# Altium schematic sheet QCopterMV_MAIN_Sch.SchDoc
size A4
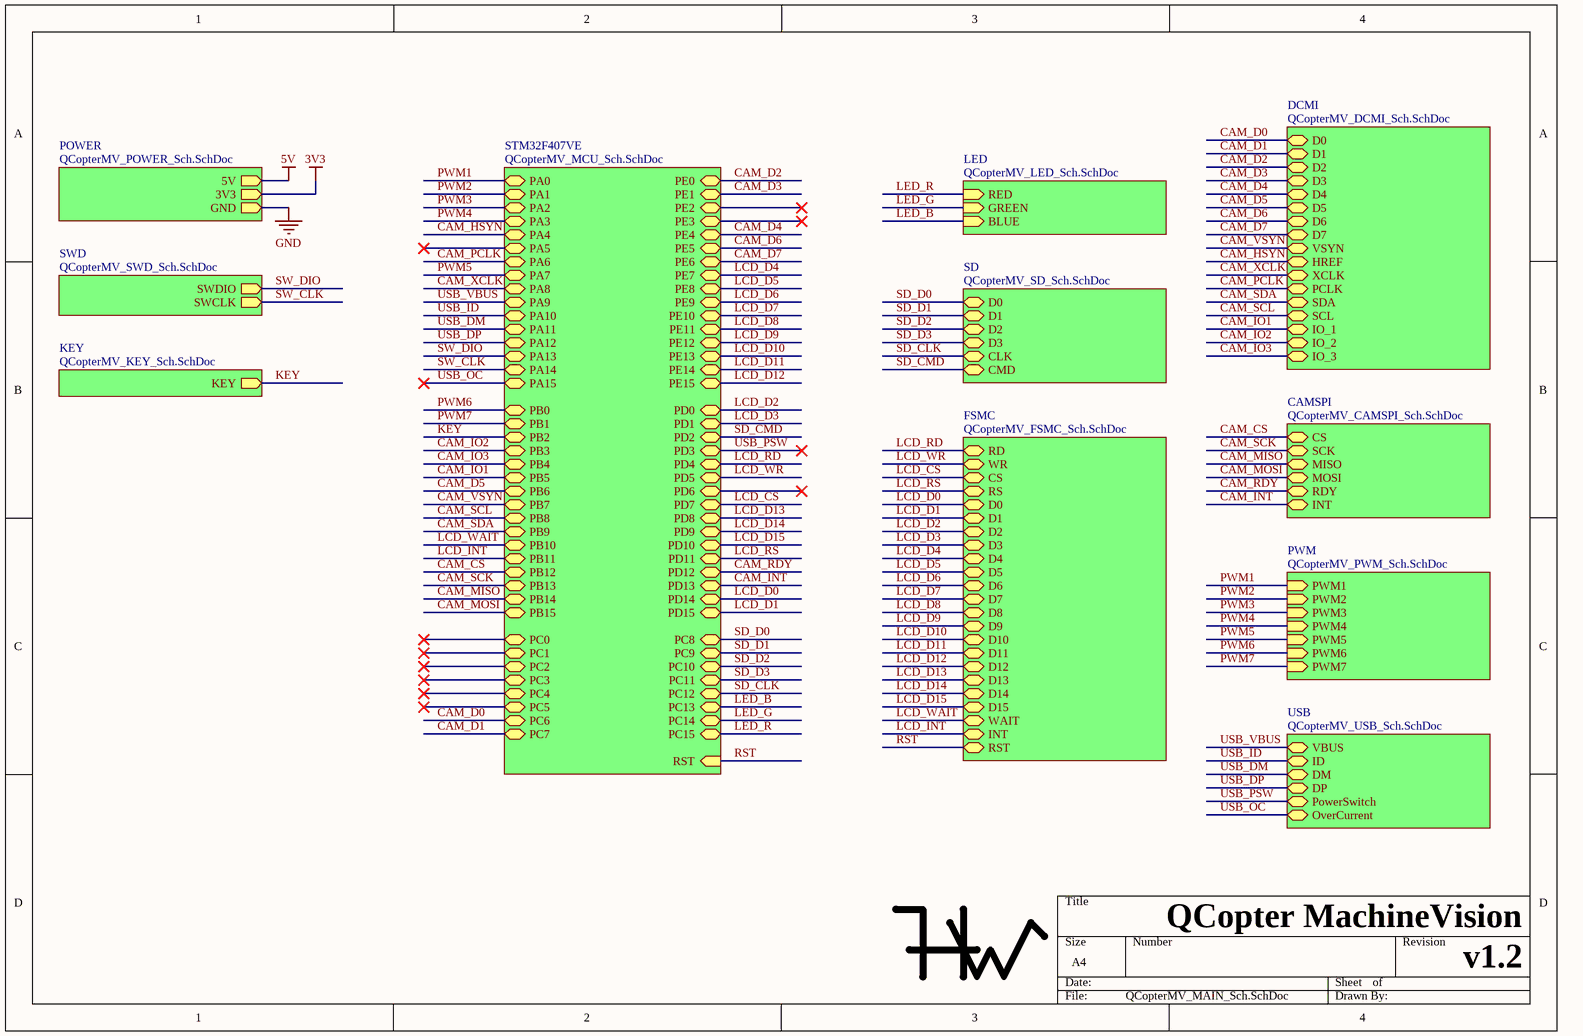
[diagram p0: QCopterMV_MAIN_Sch.SchDoc]

## Parts
Mark1  Mark  [HW_Mark]  (value not drawn)

## Sub-sheets
CAMSPI = QCopterMV_CAMSPI_Sch.SchDoc: MISO, CS, MOSI, SCK, RDY, INT
DCMI = QCopterMV_DCMI_Sch.SchDoc: D1, D0, D2, D3, D4, VSYN, HREF, PCLK, XCLK, SCL, SDA, D5, D6, D7, IO_1, IO_2, IO_3
FSMC = QCopterMV_FSMC_Sch.SchDoc: RS, CS, WR, RD, RST, D0, D1, D2, D3, D4, D5, D6, D7, D8, D9, D10, D11, D12, D13, D14, D15, WAIT, INT
KEY = QCopterMV_KEY_Sch.SchDoc: KEY (out)
LED = QCopterMV_LED_Sch.SchDoc: RED (in), GREEN (in), BLUE (in)
POWER = QCopterMV_POWER_Sch.SchDoc: 3V3 (out), 5V (out), GND (out)
PWM = QCopterMV_PWM_Sch.SchDoc: PWM7 (in), PWM1 (in), PWM2 (in), PWM3 (in), PWM4 (in), PWM5 (in), PWM6 (in)
SD = QCopterMV_SD_Sch.SchDoc: D0, CLK, CMD, D1, D2, D3
STM32F407VE = QCopterMV_MCU_Sch.SchDoc: PA0, PA1, PA2, PA3, PA4, PA5, PA6, PA7, PA8, PA9, PA10, PA11, PA12, PA13, PA14, PA15, PB0, PB1, PB2, PB3, PB4, PB5, PB6, PB7, PB8, PB9, PB10, PB11, PB12, PB13, PB14, PB15, PC0, PC1, PC2, PC3, PC4, PC5, PC6, PC7, PC8, PC9, PC10, PC11, PC12, PC13, PC14, PC15, PD0, PD1, PD2, PD3, PD4, PD5, PD6, PD7, PD8, PD9, PD10, PD11, PD12, PD13, PD14, PD15, RST (in), PE0, PE1, PE2, PE3, PE4, PE5, PE6, PE7, PE8, PE9, PE10, PE11, PE12, PE13, PE14, PE15
SWD = QCopterMV_SWD_Sch.SchDoc: SWDIO (out), SWCLK (out)
USB = QCopterMV_USB_Sch.SchDoc: VBUS, ID, DM, DP, PowerSwitch, OverCurrent

## Nets
3V3: sheet POWER/3V3
5V: sheet POWER/5V
GND: sheet POWER/GND
CAM_CS: sheet STM32F407VE/PB12, sheet CAMSPI/CS
CAM_D0: sheet DCMI/D0, sheet STM32F407VE/PC6
CAM_D1: sheet DCMI/D1, sheet STM32F407VE/PC7
CAM_D2: sheet DCMI/D2, sheet STM32F407VE/PE0
CAM_D3: sheet DCMI/D3, sheet STM32F407VE/PE1
CAM_D4: sheet DCMI/D4, sheet STM32F407VE/PE4
CAM_D5: sheet DCMI/D5, sheet STM32F407VE/PB6
CAM_D6: sheet DCMI/D6, sheet STM32F407VE/PE5
CAM_D7: sheet DCMI/D7, sheet STM32F407VE/PE6
CAM_HSYN: sheet DCMI/HREF, sheet STM32F407VE/PA4
CAM_INT: sheet STM32F407VE/PD13, sheet CAMSPI/INT
CAM_IO1: sheet DCMI/IO_1, sheet STM32F407VE/PB5
CAM_IO2: sheet DCMI/IO_2, sheet STM32F407VE/PB3
CAM_IO3: sheet DCMI/IO_3, sheet STM32F407VE/PB4
CAM_MISO: sheet STM32F407VE/PB14, sheet CAMSPI/MISO
CAM_MOSI: sheet STM32F407VE/PB15, sheet CAMSPI/MOSI
CAM_PCLK: sheet DCMI/PCLK, sheet STM32F407VE/PA6
CAM_RDY: sheet STM32F407VE/PD12, sheet CAMSPI/RDY
CAM_SCK: sheet STM32F407VE/PB13, sheet CAMSPI/SCK
CAM_SCL: sheet DCMI/SCL, sheet STM32F407VE/PB8
CAM_SDA: sheet DCMI/SDA, sheet STM32F407VE/PB9
CAM_VSYN: sheet DCMI/VSYN, sheet STM32F407VE/PB7
CAM_XCLK: sheet DCMI/XCLK, sheet STM32F407VE/PA8
KEY: sheet KEY/KEY, sheet STM32F407VE/PB2
LCD_CS: sheet STM32F407VE/PD7, sheet FSMC/CS
LCD_D0: sheet STM32F407VE/PD14, sheet FSMC/D0
LCD_D1: sheet STM32F407VE/PD15, sheet FSMC/D1
LCD_D2: sheet STM32F407VE/PD0, sheet FSMC/D2
LCD_D3: sheet STM32F407VE/PD1, sheet FSMC/D3
LCD_D4: sheet STM32F407VE/PE7, sheet FSMC/D4
LCD_D5: sheet STM32F407VE/PE8, sheet FSMC/D5
LCD_D6: sheet STM32F407VE/PE9, sheet FSMC/D6
LCD_D7: sheet STM32F407VE/PE10, sheet FSMC/D7
LCD_D8: sheet STM32F407VE/PE11, sheet FSMC/D8
LCD_D9: sheet STM32F407VE/PE12, sheet FSMC/D9
LCD_D10: sheet STM32F407VE/PE13, sheet FSMC/D10
LCD_D11: sheet STM32F407VE/PE14, sheet FSMC/D11
LCD_D12: sheet STM32F407VE/PE15, sheet FSMC/D12
LCD_D13: sheet STM32F407VE/PD8, sheet FSMC/D13
LCD_D14: sheet STM32F407VE/PD9, sheet FSMC/D14
LCD_D15: sheet STM32F407VE/PD10, sheet FSMC/D15
LCD_INT: sheet STM32F407VE/PB11, sheet FSMC/INT
LCD_RD: sheet STM32F407VE/PD4, sheet FSMC/RD
LCD_RS: sheet STM32F407VE/PD11, sheet FSMC/RS
LCD_WAIT: sheet STM32F407VE/PB10, sheet FSMC/WAIT
LCD_WR: sheet STM32F407VE/PD5, sheet FSMC/WR
LED_B: sheet LED/BLUE, sheet STM32F407VE/PC13
LED_G: sheet LED/GREEN, sheet STM32F407VE/PC14
LED_R: sheet LED/RED, sheet STM32F407VE/PC15
PWM1: sheet PWM/PWM1, sheet STM32F407VE/PA0
PWM2: sheet PWM/PWM2, sheet STM32F407VE/PA1
PWM3: sheet PWM/PWM3, sheet STM32F407VE/PA2
PWM4: sheet PWM/PWM4, sheet STM32F407VE/PA3
PWM5: sheet PWM/PWM5, sheet STM32F407VE/PA7
PWM6: sheet PWM/PWM6, sheet STM32F407VE/PB0
PWM7: sheet PWM/PWM7, sheet STM32F407VE/PB1
RST: sheet STM32F407VE/RST, sheet FSMC/RST
SD_CLK: sheet SD/CLK, sheet STM32F407VE/PC12
SD_CMD: sheet SD/CMD, sheet STM32F407VE/PD2
SD_D0: sheet SD/D0, sheet STM32F407VE/PC8
SD_D1: sheet SD/D1, sheet STM32F407VE/PC9
SD_D2: sheet SD/D2, sheet STM32F407VE/PC10
SD_D3: sheet SD/D3, sheet STM32F407VE/PC11
SW_CLK: sheet SWD/SWCLK, sheet STM32F407VE/PA14
SW_DIO: sheet SWD/SWDIO, sheet STM32F407VE/PA13
USB_DM: sheet STM32F407VE/PA11, sheet USB/DM
USB_DP: sheet STM32F407VE/PA12, sheet USB/DP
USB_ID: sheet STM32F407VE/PA10, sheet USB/ID
USB_OC: sheet STM32F407VE/PA15, sheet USB/OverCurrent
USB_PSW: sheet STM32F407VE/PD3, sheet USB/PowerSwitch
USB_VBUS: sheet STM32F407VE/PA9, sheet USB/VBUS

## Notes on the sheet
- QCopter MachineVision
- v1.2

## Library data of the parts
Mark1 = HW